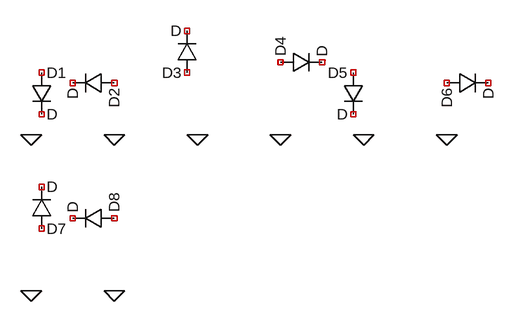
[diagram p0: schematic orientation_grid.asc]
orientation_grid.asc, the LTspice schematic file:
Version 4
SHEET 1 880 680
FLAG 96 192 0
FLAG 224 192 0
FLAG 352 192 0
FLAG 480 192 0
FLAG 608 192 0
FLAG 736 192 0
FLAG 96 432 0
FLAG 224 432 0
SYMBOL diode 96 96 R0
SYMATTR InstName D1
SYMBOL diode 224 96 R90
SYMATTR InstName D2
SYMBOL diode 352 96 R180
SYMATTR InstName D3
SYMBOL diode 480 96 R270
SYMATTR InstName D4
SYMBOL diode 608 96 M0
SYMATTR InstName D5
SYMBOL diode 736 96 M90
SYMATTR InstName D6
SYMBOL diode 96 336 M180
SYMATTR InstName D7
SYMBOL diode 224 336 M270
SYMATTR InstName D8

The netlist it stands for:
* orientation_grid.asc
D1 NC_01 NC_02 D
D2 NC_03 NC_04 D
D3 NC_05 NC_06 D
D4 NC_07 NC_08 D
D5 NC_09 NC_10 D
D6 NC_11 NC_12 D
D7 NC_13 NC_14 D
D8 NC_15 NC_16 D
.model D D
.lib standard.dio
.backanno
.end